# Altium schematic sheet SallenKeyLowPass.SchDoc
size A4
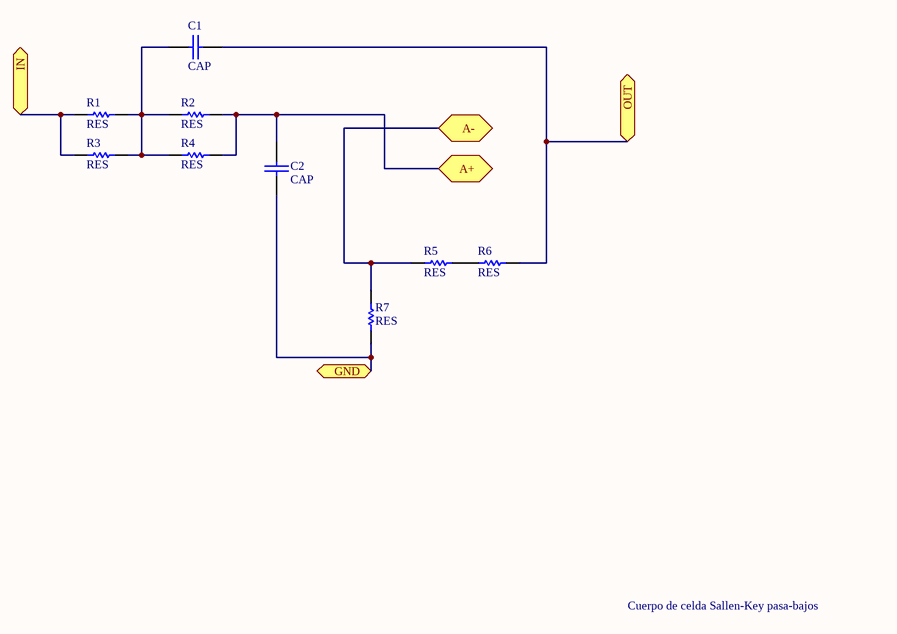
[diagram p0: SallenKeyLowPass.SchDoc]

## Parts
C1  CAP  [CAP100]
C2  CAP  [CAP100]
R1  RES  [RES300]
R2  RES  [RES300]
R3  RES  [RES300]
R4  RES  [RES300]
R5  RES  [RES300]
R6  RES  [RES300]
R7  RES  [RES300]

## Ports
A+, A-, GND, IN, OUT

## Nets
A+: C2.1 R2.2 R4.2 ; port A+
A-: R5.2 R7.2 ; port A-
GND: C2.2 R7.1 ; port GND
IN: R1.1 R3.1 ; port IN
OUT: C1.2 R6.1 ; port OUT
NetC1_1: C1.1 R1.2 R2.1 R3.2 R4.1
NetR5_1: R5.1 R6.2

## Notes on the sheet
- Cuerpo de celda Sallen-Key pasa-bajos